# Altium project PCB Version 0.3.PrjPcb (part 2 of 2)

## Sheet ELRS.SchDoc
size A3; SheetNumber: 4; SheetTotal: 13; SPICEModelCacheIXSEWQWZ: <root> / <DocumentId>IXSEWQWZ</DocumentId> / <CacheFrame Number="0"> / <Model Name="0603_885012106031_10uf" Kind="CKT"> / <Text>******* / .subckt 0603_885012106031_10uF 1 2 / Rser 1 3 0.0105 / Lser 2 4 0.0000000008 / C1 3 4 0.00001 / Rpar 3 4 10000000 / .ends 0603_885012106031_10uF</Text> / </Model> / </CacheFrame> / </root>
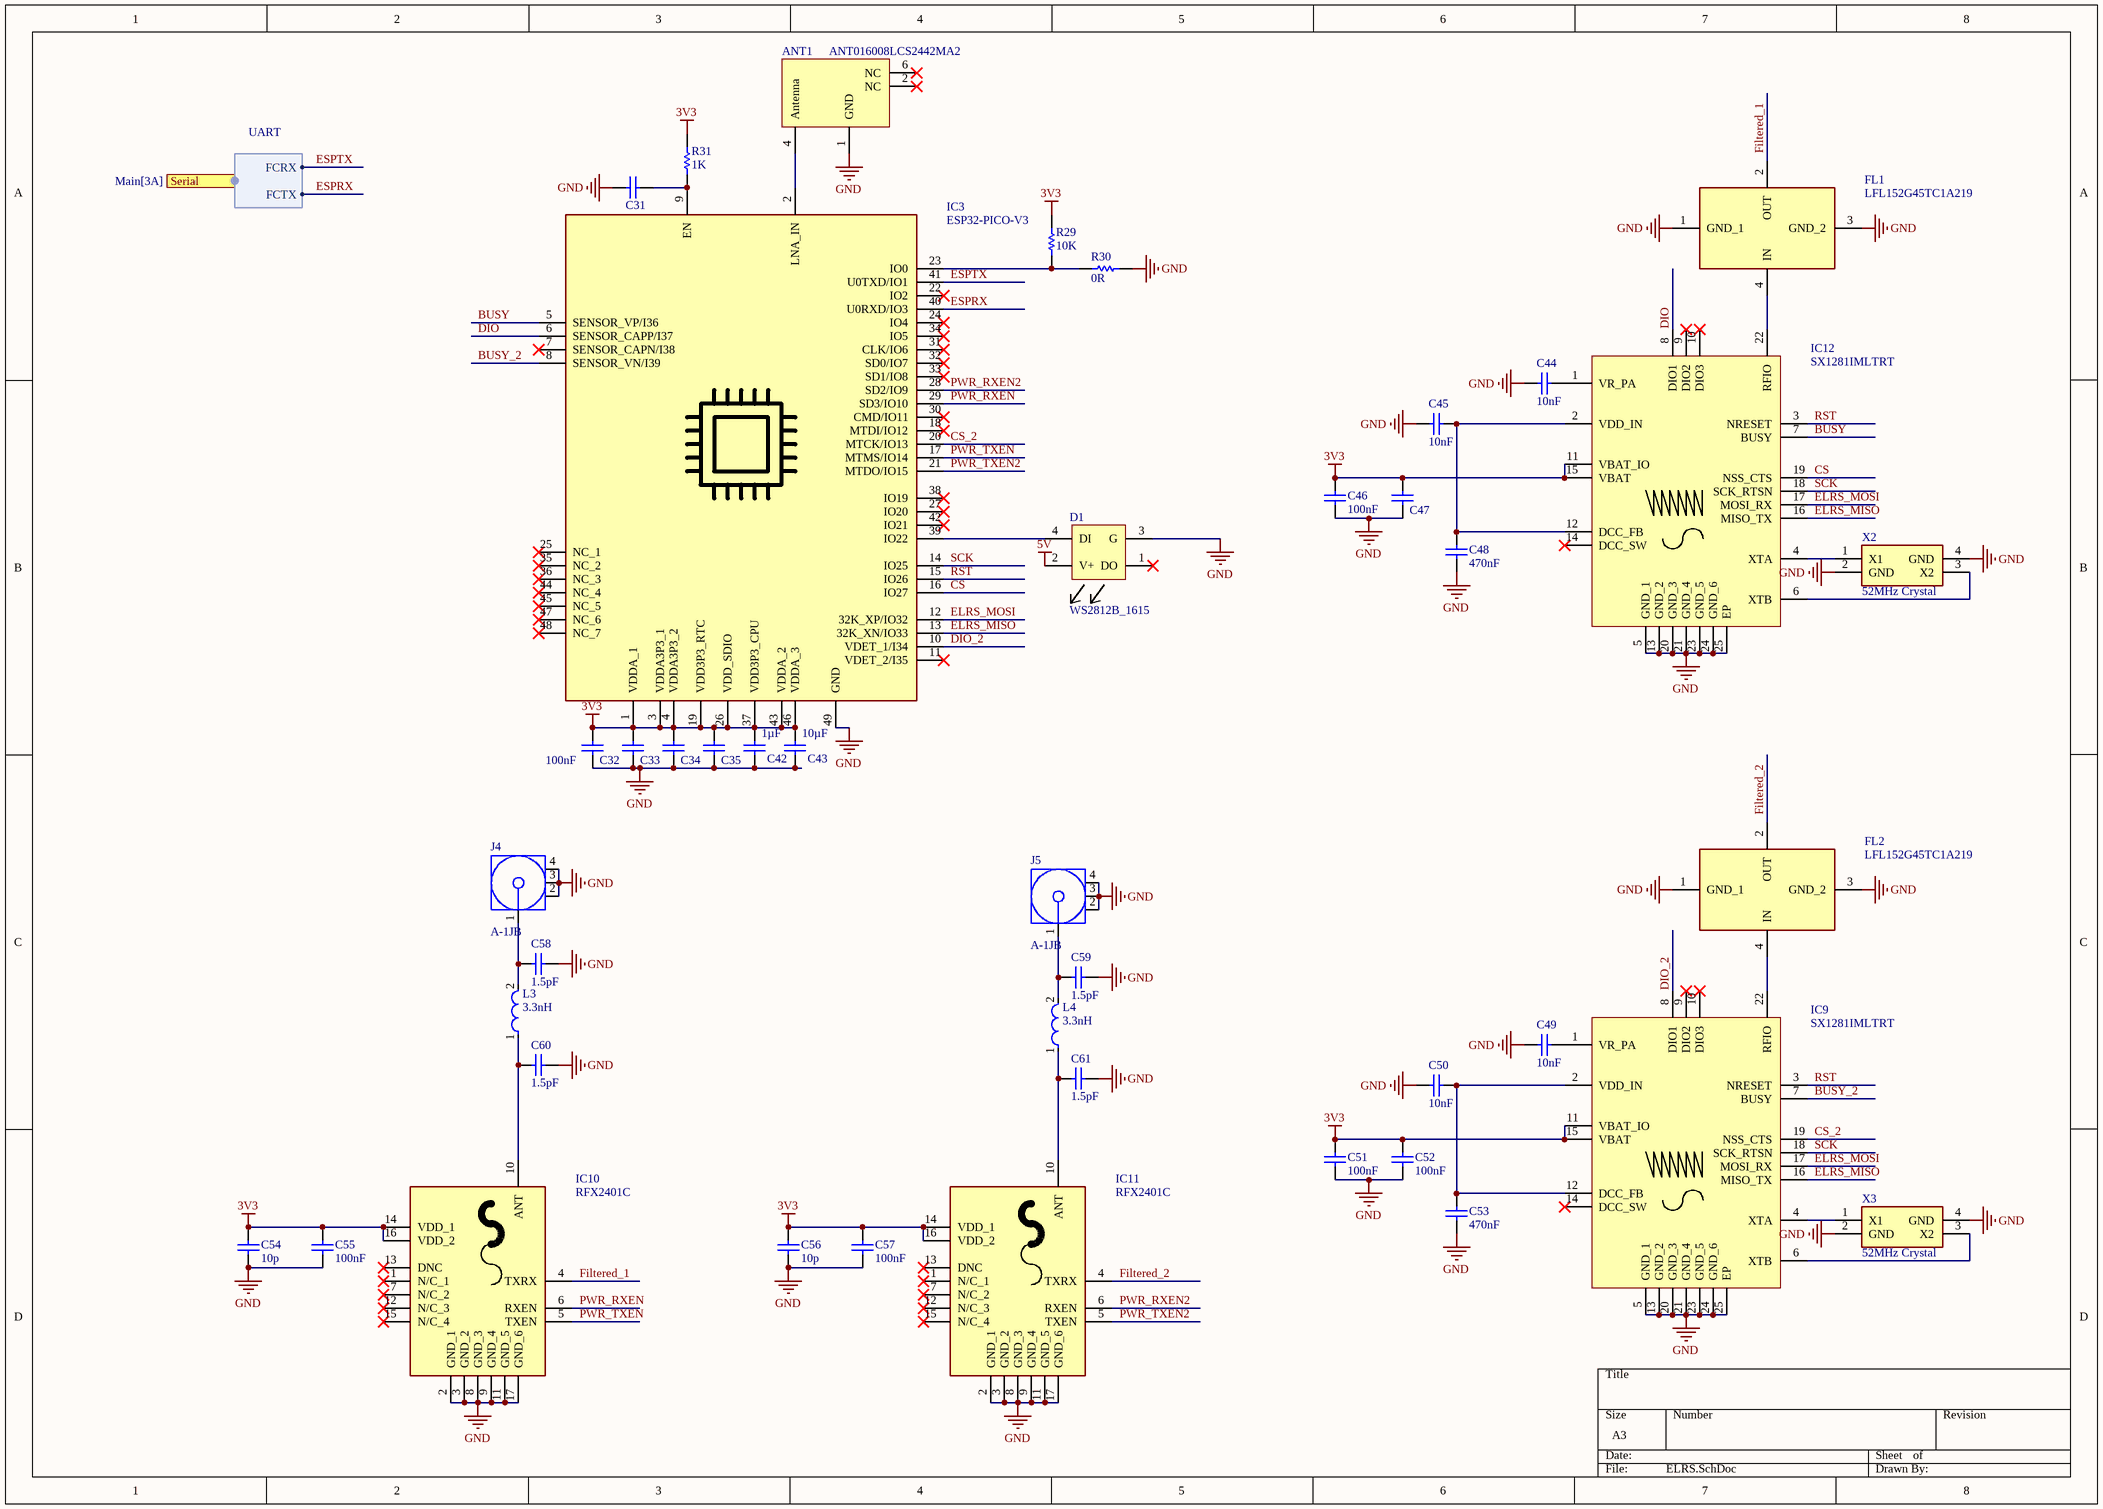
[diagram p11: ELRS.SchDoc]

### Parts
ANT1  ANT016008LCS2442MA2  [ANT016008LCS2442MA2]
C31  100nF  [WCAP-CSGP_0603_L1.6W0.8H0.8_Reflow]  (value not drawn)
C32  100nF  [WCAP-CSGP_0603_L1.6W0.8H0.8_Reflow]
C33  100nF  [WCAP-CSGP_0603_L1.6W0.8H0.8_Reflow]  (value not drawn)
C34  100nF  [WCAP-CSGP_0603_L1.6W0.8H0.8_Reflow]  (value not drawn)
C35  100nF  [WCAP-CSGP_0603_L1.6W0.8H0.8_Reflow]  (value not drawn)
C42  1µF  [WCAP-CSGP_0603_L1.6W0.8H0.8_Reflow]
C43  10µF  [WCAP-CSGP_0603_L1.6W0.8H0.8_Reflow]
C44  10nF  [0402 cap]
C45  10nF  [0402 cap]
C46  100nF  [0402 cap]
C47  100nF  [WCAP-CSGP_0603_L1.6W0.8H0.8_Reflow]  (value not drawn)
C48  470nF  [0402 cap]
C49  10nF  [0402 cap]
C50  10nF  [0402 cap]
C51  100nF  [0402 cap]
C52  100nF  [0402 cap]
C53  470nF  [0402 cap]
C54  10p  [0402 cap]
C55  100nF  [0402 cap]
C56  10p  [0402 cap]
C57  100nF  [0402 cap]
C58  1.5pF  [0402 cap]
C59  1.5pF  [0402 cap]
C60  1.5pF  [0402 cap]
C61  1.5pF  [0402 cap]
D1  WS2812B_1615  [WS2812B_1615]
FL1  LFL152G45TC1A219  [LFL152G45TC1A219]
FL2  LFL152G45TC1A219  [LFL152G45TC1A219]
IC3  ESP32-PICO-V3  [ESP32PICOV3]
IC9  SX1281IMLTRT  [QFN50P400X400X100-25N-D]
IC10  RFX2401C  [QFN50P300X300X60-17N-D]
IC11  RFX2401C  [QFN50P300X300X60-17N-D]
IC12  SX1281IMLTRT  [QFN50P400X400X100-25N-D]
J4  A-1JB  [AMPH-A-1JB_V]
J5  A-1JB  [AMPH-A-1JB_V]
L3  3.3nH  [FP-LQW15AN_00-W0_6-0_1-MFG]
L4  3.3nH  [FP-LQW15AN_00-W0_6-0_1-MFG]
R29  10K  [0402 resistor]
R30  0R  [0402 resistor]
R31  1K  [0402 resistor]
X2  52MHz Crystal  [2016 Crystal]
X3  52MHz Crystal  [2016 Crystal]

### Ports
Serial (harness UART, see Main[3A])

### Harnesses
UART: FCRX, FCTX

### Nets
3V3: C32.2 C33.2 C34.2 C35.2 C42.2 C43.2 C46.2 C47.2 C51.2 C52.2 C54.2 C55.2 C56.2 C57.2 IC3.1(VDDA_1) IC3.3(VDDA3P3_1) IC3.4(VDDA3P3_2) IC3.19(VDD3P3_RTC) IC3.26(VDD_SDIO) IC3.37(VDD3P3_CPU) IC3.43(VDDA_2) IC3.46(VDDA_3) IC9.11(VBAT_IO) IC9.15(VBAT) IC10.14(VDD_1) IC10.16(VDD_2) IC11.14(VDD_1) IC11.16(VDD_2) IC12.11(VBAT_IO) IC12.15(VBAT) R29.2 R31.2
5V: D1.2(V+)
GND: ANT1.1(GND) C31.2 C32.1 C33.1 C34.1 C35.1 C42.1 C43.1 C44.1 C45.1 C46.1 C47.1 C48.1 C49.1 C50.1 C51.1 C52.1 C53.1 C54.1 C55.1 C56.1 C57.1 C58.2 C59.2 C60.2 C61.2 D1.3(G) FL1.1(GND_1) FL1.3(GND_2) FL2.1(GND_1) FL2.3(GND_2) IC3.49(GND) IC9.5(GND_1) IC9.13(GND_2) IC9.20(GND_3) IC9.21(GND_4) IC9.23(GND_5) IC9.24(GND_6) IC9.25(EP) IC10.2(GND_1) IC10.3(GND_2) IC10.8(GND_3) IC10.9(GND_4) IC10.11(GND_5) IC10.17(GND_6) IC11.2(GND_1) IC11.3(GND_2) IC11.8(GND_3) IC11.9(GND_4) IC11.11(GND_5) IC11.17(GND_6) IC12.5(GND_1) IC12.13(GND_2) IC12.20(GND_3) IC12.21(GND_4) IC12.23(GND_5) IC12.24(GND_6) IC12.25(EP) J4.2 J4.3 J4.4 J5.2 J5.3 J5.4 R30.2 X2.2(GND) X2.4(GND) X3.2(GND) X3.4(GND)
BUSY: IC3.5(SENSOR_VP/I36) IC12.7(BUSY)
BUSY_2: IC3.8(SENSOR_VN/I39) IC9.7(BUSY)
CS: IC3.16(IO27) IC12.19(NSS_CTS)
CS_2: IC3.20(MTCK/IO13) IC9.19(NSS_CTS)
DIO: IC3.6(SENSOR_CAPP/I37) IC12.8(DIO1)
DIO_2: IC3.10(VDET_1/I34) IC9.8(DIO1)
ELRS_MISO: IC3.13(32K_XN/IO33) IC9.16(MISO_TX) IC12.16(MISO_TX)
ELRS_MOSI: IC3.12(32K_XP/IO32) IC9.17(MOSI_RX) IC12.17(MOSI_RX)
ESPRX: IC3.40(U0RXD/IO3) ; port Serial.FCTX
ESPTX: IC3.41(U0TXD/IO1) ; port Serial.FCRX
Filtered_1: FL1.2(OUT) IC10.4(TXRX)
Filtered_2: FL2.2(OUT) IC11.4(TXRX)
PWR_RXEN: IC3.29(SD3/IO10) IC10.6(RXEN)
PWR_RXEN2: IC3.28(SD2/IO9) IC11.6(RXEN)
PWR_TXEN: IC3.17(MTMS/IO14) IC10.5(TXEN)
PWR_TXEN2: IC3.21(MTDO/IO15) IC11.5(TXEN)
RST: IC3.15(IO26) IC9.3(NRESET) IC12.3(NRESET)
SCK: IC3.14(IO25) IC9.18(SCK_RTSN) IC12.18(SCK_RTSN)
NetANT1_4: ANT1.4(Antenna) IC3.2(LNA_IN)
NetC31_1: C31.1 IC3.9(EN) R31.1
NetC44_2: C44.2 IC12.1(VR_PA)
NetC45_2: C45.2 C48.2 IC12.2(VDD_IN) IC12.12(DCC_FB)
NetC49_2: C49.2 IC9.1(VR_PA)
NetC50_2: C50.2 C53.2 IC9.2(VDD_IN) IC9.12(DCC_FB)
NetC58_1: C58.1 J4.1 L3.2
NetC59_1: C59.1 J5.1 L4.2
NetC60_1: C60.1 IC10.10(ANT) L3.1
NetC61_1: C61.1 IC11.10(ANT) L4.1
NetD1_4: D1.4(DI) IC3.39(IO22)
NetFL1_4: FL1.4(IN) IC12.22(RFIO)
NetFL2_4: FL2.4(IN) IC9.22(RFIO)
NetIC3_23: IC3.23(IO0) R29.1 R30.1
NetIC9_4: IC9.4(XTA) X3.1(X1)
NetIC9_6: IC9.6(XTB) X3.3(X2)
NetIC12_4: IC12.4(XTA) X2.1(X1)
NetIC12_6: IC12.6(XTB) X2.3(X2)

Not connected (* = marked no-connect by the designer): ANT1 2(NC)* 6(NC)*; D1 1(DO)*; IC3 7(SENSOR_CAPN/I38)* 11(VDET_2/I35)* 18(MTDI/IO12)* 22(IO2)* 24(IO4)* 25(NC_1)* 27(IO20)* 30(CMD/IO11)* 31(CLK/IO6)* 32(SD0/IO7)* 33(SD1/IO8)* 34(IO5)* 35(NC_2)* 36(NC_3)* 38(IO19)* 42(IO21)* 44(NC_4)* 45(NC_5)* 47(NC_6)* 48(NC_7)*; IC9 9(DIO2)* 10(DIO3)* 14(DCC_SW)*; IC10 1(N/C_1)* 7(N/C_2)* 12(N/C_3)* 13(DNC)* 15(N/C_4)*; IC11 1(N/C_1)* 7(N/C_2)* 12(N/C_3)* 13(DNC)* 15(N/C_4)*; IC12 9(DIO2)* 10(DIO3)* 14(DCC_SW)*

### Library data of the parts
ANT1 = ANT016008LCS2442MA2: Antenna; Manufacturer_Name: TDK; Datasheet Link: https://product.tdk.com/system/files/dam/doc/product/rf/rf/antenna/catalog/rf_ant_ant016008lcs2442ma2_summary_en.pdf; Height: 0.4mm; Manufacturer_Part_Number: ANT016008LCS2442MA2; Mouser Part Number: 810-ANT168LCS2442MA2; Mouser Price/Stock: https://www.mouser.co.uk/ProductDetail/TDK/ANT016008LCS2442MA2?qs=NlTBjZZh8j0h3jcBIFCiDg%3D%3D; Arrow Part Number: ANT016008LCS2442MA2; Arrow Price/Stock: https://www.arrow.com/en/products/ant016008lcs2442ma2/tdk
C31-C35 C47 = 885012206095: WCAP-CSGP Multilayer Ceramic Chip Capacitor, General Purpose, size 0603, X7R, 100nF, 50VDC; Manufacturer: Wurth Elektronik; Case/Size Code: 0603; Capacitance Tolerance: +/-10%; Dissipation Factor: 3%; Insulation Resistance: 5GΩ; Rated Voltage (DC): 50V; Technical Reference: X7R0603104K050DFCT10000; Manufacturer Part Number: 885012206095; Category: Multilayer Ceramic Chip Capacitors; Match Code: WCAP-CSGP; ComponentLink1Description: Website Link; ComponentLink1URL: https://www.we-online.com/redexpert/article/885012206095?ad; ComponentLink2Description: Datasheet Link; ComponentLink2URL: https://www.we-online.com/redexpert/spec/885012206095?ad; Mount: Surface Mount; Operating Temperature Max: 125°C; Operating Temperature Min: -55°C; Packaging: Tape and Reel; Length: 1.6mm; Width: 0.8mm; Height: 0.8mm; Capacitance: 100nF; Ceramic Type: X7R
C42 = 885012206076: WCAP-CSGP Multilayer Ceramic Chip Capacitor, General Purpose, size 0603, X7R, 1µF, 25VDC; Manufacturer: Wurth Elektronik; Case/Size Code: 0603; Capacitance Tolerance: +/-10%; Dissipation Factor: 10%; Insulation Resistance: 0.5GΩ; Rated Voltage (DC): 25V; Technical Reference: X7R0603105K025DFCT10000; Manufacturer Part Number: 885012206076; Category: Multilayer Ceramic Chip Capacitors; Match Code: WCAP-CSGP; ComponentLink1Description: Website Link; ComponentLink1URL: https://www.we-online.com/redexpert/article/885012206076?ad; ComponentLink2Description: Datasheet Link; ComponentLink2URL: https://www.we-online.com/redexpert/spec/885012206076?ad; Mount: Surface Mount; Operating Temperature Max: 125°C; Operating Temperature Min: -55°C; Packaging: Tape and Reel; Length: 1.6mm; Width: 0.8mm; Height: 0.8mm; Capacitance: 1µF; Ceramic Type: X7R
C43 = 885012106031: WCAP-CSGP Multilayer Ceramic Chip Capacitor, General Purpose, size 0603, X5R, 10µF, 25VDC; Manufacturer: Wurth Elektronik; Case/Size Code: 0603; Capacitance Tolerance: +/20%; Dissipation Factor: 20%; Insulation Resistance: 0.01GΩ; Rated Voltage (DC): 25V; Technical Reference: X5R0603106M025DFCT10000; Manufacturer Part Number: 885012106031; Category: Multilayer Ceramic Chip Capacitors; Match Code: WCAP-CSGP; ComponentLink1Description: Website Link; ComponentLink1URL: https://www.we-online.com/redexpert/article/885012106031?ad; ComponentLink2Description: Datasheet Link; ComponentLink2URL: https://www.we-online.com/redexpert/spec/885012106031?ad; Mount: Surface Mount; Operating Temperature Max: 85°C; Operating Temperature Min: -55°C; Packaging: Tape and Reel; Length: 1.6mm; Width: 0.8mm; Height: 0.8mm; Capacitance: 10µF; Ceramic Type: X5R
C44-C46 C48-C57 = Capacitor 0402 100nF
  C44 C45 C49 C50: Value: 10nF
  C46 C51 C52 C55 C57: Value: 100nF
  C48 C53: Value: 470nF
  C54 C56: Value: 10p
C58-C61 = Capacitor 0402 100nF: CL05C1R5BB5NNNC; Value: 1.5pF
D1 = WS2812B_1615: XINGLIGHT XL-1615RGBC-WS2812B
FL1 FL2 = LFL152G45TC1A219: Filter; Manufacturer_Name: Murata Electronics; Datasheet Link: https://www.murata.com/en-us/products/productdetail?partno=LFL152G45TC1A219; Height: 0.4mm; Manufacturer_Part_Number: LFL152G45TC1A219; Mouser Part Number: 81-LFL152G45TC1A219; Mouser Price/Stock: https://www.mouser.co.uk/ProductDetail/Murata-Electronics/LFL152G45TC1A219?qs=%2F%252BYoplLUB5hWhU%2FZs0btqg%3D%3D; Arrow Part Number: LFL152G45TC1A219; Arrow Price/Stock: https://www.arrow.com/en/products/lfl152g45tc1a219/murata-manufacturing?region=nac
IC3 = ESP32-PICO-V3: Integrated Circuit; Manufacturer_Name: Espressif Systems; Datasheet Link: https://kr.mouser.com/datasheet/2/891/esp32-pico-v3_datasheet_en-1842685.pdf; Height: 1.04mm; Manufacturer_Part_Number: ESP32-PICO-V3; Mouser Part Number: 356-ESP32-PICO-V3; Mouser Price/Stock: https://www.mouser.co.uk/ProductDetail/Espressif-Systems/ESP32-PICO-V3?qs=GBLSl2Akirs311o8knsnZA%3D%3D
IC9 IC12 = SX1281IMLTRT: Integrated Circuit; Manufacturer_Name: SEMTECH; Datasheet Link: https://www.arrow.com/en/products/sx1281imltrt/semtech; Height: 1mm; Manufacturer_Part_Number: SX1281IMLTRT; Mouser Part Number: 947-SX1281IMLTRT; Mouser Price/Stock: https://www.mouser.co.uk/ProductDetail/Semtech/SX1281IMLTRT?qs=5aG0NVq1C4xR1aFoShVcjg%3D%3D; Arrow Part Number: SX1281IMLTRT; Arrow Price/Stock: https://www.arrow.com/en/products/sx1281imltrt/semtech?region=nac
IC10 IC11 = RFX2401C: Integrated Circuit; Manufacturer_Name: Skyworks; Datasheet Link: https://eu.mouser.com/datasheet/2/472/RFX2401C_204359B-1524606.pdf; Height: 0.6mm; Manufacturer_Part_Number: RFX2401C; Mouser Part Number: 477-RFX2401C; Mouser Price/Stock: https://www.mouser.co.uk/ProductDetail/Skyworks-Solutions-Inc/RFX2401C?qs=dBWc1juS%252B3ydEXrKsuxQ7A%3D%3D
J4 J5 = CMP-1743-00001-1: AMC PCB Jack, 0 to 60 GHz, 60 V, -40 to 90 degC, 4-Pin SMD, RoHS, Tape and Reel; Capacitance: 100 uF; Case\Package: 2917; Voltage Rating (DC): 10 V; ESR: 700 mohm; Tolerance: 10%; ComponentLink1Description: Datasheet; PackageDescription: 4-Pin Surface Mount Device, Body 2.6 x 2.6 mm; Radiation Hardening: No; Package Quantity: 1; REACH SVHC: No SVHC; DatasheetVersion: Rev. K, 05/2016; ComponentLink1URL: http://drawings.amphenolrf.com/Customer_Outline/CA-1JB.pdf; Pins: 2; Packaging: Tape and Reel; Min Operating Temperature: -55 degC; RoHSCompliant: true; Length: 7.3 mm; PackageReference: A-1JB; Weight: 0.023634 oz; Mount: Surface Mount; Voltage Rating: 10 V; Max Operating Temperature: 125 degC; Height: 3.1 mm; Case Code (Imperial): 2917; Case Code (Metric): 7343; Width: 4.3 mm
L3 L4 = CMP-06042-000827-1: MLG1005S3N3BT000; Inductance: 3.9nH; Shielding: Unshielded; Self Resonant Frequency: 10GHz; Core Material: Air; Current: 750mA; Test Frequency: 100MHz; DC Resistance (DCR): 70mR; Length: 1mm; Height: 0.5mm; Case Code (Metric): 1005; Lead Free: Lead Free; Military Standard: Not; Mount: Surface Mount; REACH SVHC: No SVHC; Current Rating: 750mA; DC Current: 750mA; Max Operating Temperature: 125°C; Package Quantity: 10000; Packaging: Tape and Reel; Case/Package: 0402; Min Operating Temperature: -55°C; Width: 0.02inch; Depth: 0.7mm; Termination: SMD/SMT; Weight: 2.8E-05oz; Number of Pins: 2; Radiation Hardening: No; Max DC Current: 750mA; Case Code (Imperial): 0402
R29-R31 = Resistor 0402 1K
  R29: Value: 10K
  R30: Value: 0R
  R31: Value: 1K
X2 X3 = HCI XC21M4-52.000: HCI XC21M4-52.000-F10NNHPL

## Nets that join several sheets
3V3: RP2040 (18 pins), Flash (C5.2 C6.2 IC2.8 R6.2), Voltage Regulators (C20.2 IC7.1), LEDs (R17.2), Baro (C17.2 IC5#1.8 R25.2 R26.2), Gyro (C18.2 C19.2 IC6.5 IC6.8), Connectors (P31.1 P31.2 U1.5), VI Sensors (D12.3 IC5#2.2 IC5#2.3 IC5#2.7), ELRS (32 pins)
5V: Voltage Regulators (7 pins), LEDs (R16.2), OSD (10 pins), Connectors (9 pins), ELRS (D1.2)
10V: Voltage Regulators (C2.2 L1.2 R1.2), LEDs (R15.2), Connectors (J3.1 P28.1 P28.2)
GND: RP2040 (12 pins), Flash (C5.1 C6.1 IC2.4), Voltage Regulators (24 pins), USB (9 pins), LEDs (6 pins), OSD (9 pins), Baro (C17.1 IC5#1.1 IC5#1.7), Gyro (C18.1 C19.1 IC6.6 IC6.7), Connectors (24 pins), VI Sensors (C22.1 IC5#2.1 R27.1), ELRS (69 pins)
USB5V: Voltage Regulators (IC8.6), USB (D3.5 P1.2 P1.11)
VBAT: Voltage Regulators (10 pins), LEDs (R14.2), Connectors (P2.2 P32.1), VI Sensors (R10.2)
Activity: RP2040 (IC1.14), LEDs (R19.2), Connectors (P36.1)
CSB: RP2040 (IC1.8), Gyro (IC6.12)
Curr_ADC: RP2040 (IC1.40), VI Sensors (IC5#2.5 IC5#2.6)
Curr_ESC: Connectors (P2.8 P27.1), VI Sensors (R28.2)
D_N: RP2040 (IC1.46), USB (R5.1)
D_P: RP2040 (IC1.47), USB (R4.1)
Debug: RP2040 (IC1.13), LEDs (R18.2), Connectors (P34.1)
ESPRX: RP2040 (IC1.2), Connectors (J3.3 P13.1 P13.2), ELRS (IC3.40)
ESPTX: RP2040 (IC1.3), Connectors (J3.4 P12.1 P12.2), ELRS (IC3.41)
Gyro_Int1: RP2040 (IC1.38), Gyro (IC6.4)
IO4: RP2040 (IC1.6), Connectors (P3.1 P3.2)
IO5: RP2040 (IC1.7), Connectors (P2.7 P4.1 P4.2)
IO24: RP2040 (IC1.36), Connectors (J2.2 P7.1 P7.2)
IO25: RP2040 (IC1.37), Connectors (J2.1 P6.1 P6.2)
M1: RP2040 (IC1.31), Connectors (P2.3 P16.1)
M2: RP2040 (IC1.32), Connectors (P2.4 P17.1)
M3: RP2040 (IC1.34), Connectors (P2.5 P18.1)
M4: RP2040 (IC1.35), Connectors (P2.6 P19.1)
MISO: RP2040 (IC1.27), OSD (IC4.11), Gyro (IC6.1)
MOSI: RP2040 (IC1.30), OSD (IC4.9), Gyro (IC6.14)
NetIC1_51: RP2040 (IC1.51), Flash (IC2.7)
NetIC1_52: RP2040 (IC1.52), Flash (IC2.6)
NetIC1_53: RP2040 (IC1.53), Flash (IC2.5)
NetIC1_54: RP2040 (IC1.54), Flash (IC2.3)
NetIC1_55: RP2040 (IC1.55), Flash (IC2.2)
NetIC1_56: RP2040 (IC1.56), Flash (IC2.1 R6.1), Connectors (R20.2)
OSD_SS: RP2040 (IC1.16), OSD (IC4.8)
SCLK: RP2040 (IC1.29), OSD (IC4.10), Gyro (IC6.13)
Spk+: RP2040 (IC1.9), Connectors (P33.1 P33.2 U1.1 U1.2)
SWCLK: RP2040 (IC1.24), Connectors (P40.1)
SWDIO: RP2040 (IC1.25), Connectors (P39.1)
U1RX: RP2040 (IC1.12), Connectors (P14.1)
U1TX: RP2040 (IC1.11), Connectors (P15.1)
Vbat_ADC: RP2040 (IC1.41), VI Sensors (IC5#2.8 IC5#2.9)
Video In: OSD (C13.2 R21.1), Connectors (P11.1 P11.2)
Video Out: OSD (R9.1), Connectors (P10.1 P10.2)